# Altium schematic sheet RASPBERRY_PI_PICO.SchDoc
size A3
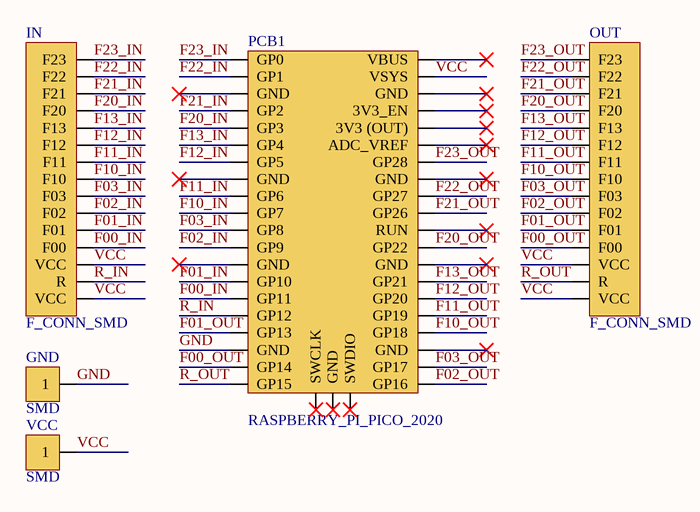
[diagram p0: RASPBERRY_PI_PICO.SchDoc]

## Parts
GND  SMD  [SMD_PAD]
IN  F_CONN_SMD  [F_CONNECTOR_SMD]
OUT  F_CONN_SMD  [F_CONNECTOR_SMD]
PCB1  RASPBERRY_PI_PICO_2020  [RASPBERRY_PI_PICO_2020\]
VCC  SMD  [SMD_PAD]

## Nets
F00_IN: IN.12(F00) PCB1.15(GP11)
F00_OUT: OUT.12(F00) PCB1.19(GP14)
F01_IN: IN.11(F01) PCB1.14(GP10)
F01_OUT: OUT.11(F01) PCB1.17(GP13)
F02_IN: IN.10(F02) PCB1.12(GP9)
F02_OUT: OUT.10(F02) PCB1.24(GP16)
F03_IN: IN.9(F03) PCB1.11(GP8)
F03_OUT: OUT.9(F03) PCB1.25(GP17)
F10_IN: IN.8(F10) PCB1.10(GP7)
F10_OUT: OUT.8(F10) PCB1.27(GP18)
F11_IN: IN.7(F11) PCB1.9(GP6)
F11_OUT: OUT.7(F11) PCB1.28(GP19)
F12_IN: IN.6(F12) PCB1.7(GP5)
F12_OUT: OUT.6(F12) PCB1.29(GP20)
F13_IN: IN.5(F13) PCB1.6(GP4)
F13_OUT: OUT.5(F13) PCB1.30(GP21)
F20_IN: IN.4(F20) PCB1.5(GP3)
F20_OUT: OUT.4(F20) PCB1.32(GP22)
F21_IN: IN.3(F21) PCB1.4(GP2)
F21_OUT: OUT.3(F21) PCB1.34(GP26)
F22_IN: IN.2(F22) PCB1.2(GP1)
F22_OUT: OUT.2(F22) PCB1.35(GP27)
F23_IN: IN.1(F23) PCB1.1(GP0)
F23_OUT: OUT.1(F23) PCB1.37(GP28)
GND: GND.1 PCB1.18(GND)
R_IN: IN.14(R) PCB1.16(GP12)
R_OUT: OUT.14(R) PCB1.20(GP15)
VCC: IN.13(VCC) IN.15(VCC) OUT.13(VCC) OUT.15(VCC) PCB1.42(VSYS) VCC.1

Not connected (* = marked no-connect by the designer): PCB1 3(GND)* 8(GND)* 13(GND)* 21(SWCLK)* 22(GND)* 23(SWDIO)* 26(GND)* 31(GND)* 33(RUN)* 36(GND)* 38(ADC_VREF)* 39(3V3_(OUT))* 40(3V3_EN)* 41(GND)* 43(VBUS)*

## Notes on the sheet
- Author:
- Date:
- Time:
- Project:
- Revision:
- Number:
- Sheet:
- /
- File:

## Library data of the parts
GND VCC = SMD_PAD
IN OUT = F_CONNECTOR_SMD